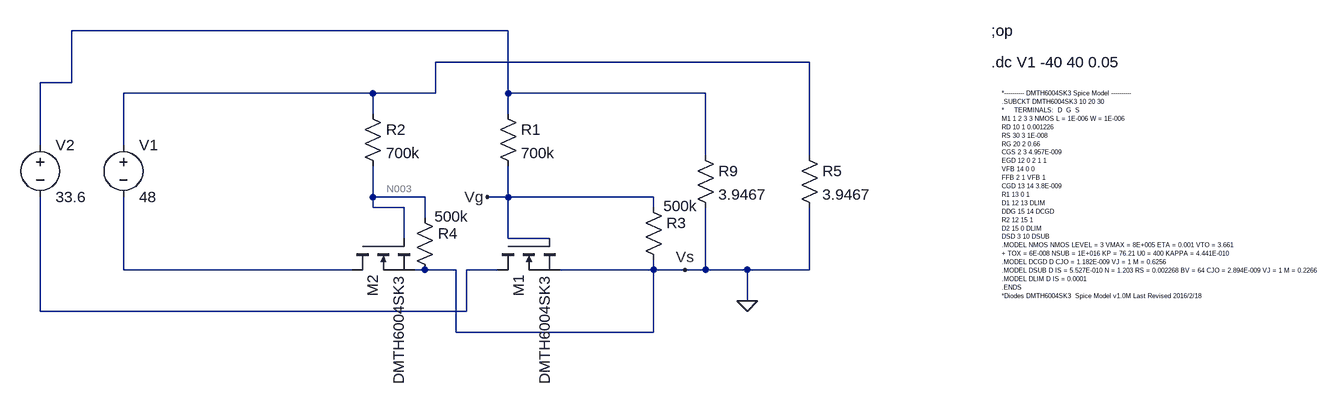
[diagram p0: schematic Dual Reverse Voltage Protection.asc]
Dual Reverse Voltage Protection.asc, the LTspice schematic file:
Version 4
SHEET 1 1812 680
WIRE 128 -992 -544 -992
WIRE 592 -944 16 -944
WIRE -544 -912 -544 -992
WIRE -544 -912 -592 -912
WIRE -80 -896 -464 -896
WIRE 16 -896 16 -944
WIRE 16 -896 -80 -896
WIRE 128 -896 128 -992
WIRE 432 -896 128 -896
WIRE -80 -864 -80 -896
WIRE 128 -864 128 -896
WIRE -592 -816 -592 -912
WIRE -464 -816 -464 -896
WIRE 432 -800 432 -896
WIRE 592 -800 592 -944
WIRE -80 -736 -80 -784
WIRE 0 -736 -80 -736
WIRE 128 -736 128 -784
WIRE 128 -736 96 -736
WIRE 352 -736 128 -736
WIRE -80 -720 -80 -736
WIRE -32 -720 -80 -720
WIRE 352 -720 352 -736
WIRE 0 -704 0 -736
WIRE -32 -672 -32 -720
WIRE 128 -672 128 -736
WIRE 192 -672 128 -672
WIRE -464 -624 -464 -736
WIRE -112 -624 -464 -624
WIRE 0 -624 -16 -624
WIRE 48 -624 0 -624
WIRE 112 -624 64 -624
WIRE 352 -624 352 -640
WIRE 352 -624 208 -624
WIRE 400 -624 352 -624
WIRE 432 -624 432 -720
WIRE 432 -624 400 -624
WIRE 496 -624 432 -624
WIRE 592 -624 592 -720
WIRE 592 -624 496 -624
WIRE 496 -576 496 -624
WIRE -592 -560 -592 -736
WIRE 64 -560 64 -624
WIRE 64 -560 -592 -560
WIRE 48 -528 48 -624
WIRE 352 -528 352 -624
WIRE 352 -528 48 -528
FLAG 496 -576 0
FLAG 400 -624 Vs
FLAG 96 -736 Vg
SYMBOL voltage -464 -832 R0
WINDOW 123 0 0 Left 2
WINDOW 39 0 0 Left 2
SYMATTR InstName V1
SYMATTR Value 48
SYMBOL res 112 -880 R0
SYMATTR InstName R1
SYMATTR Value 700k
SYMBOL res 336 -736 R0
WINDOW 3 31 14 Left 2
SYMATTR Value 500k
SYMATTR InstName R3
SYMBOL res 416 -816 R0
SYMATTR InstName R9
SYMATTR Value 3.9467
SYMBOL res -96 -880 R0
SYMATTR InstName R2
SYMATTR Value 700k
SYMBOL res -16 -720 R0
WINDOW 3 31 14 Left 2
SYMATTR Value 500k
SYMATTR InstName R4
SYMBOL nmos 112 -672 M90
SYMATTR InstName M1
SYMATTR Value DMTH6004SK3
SYMATTR Prefix X
SYMBOL nmos -112 -672 M90
SYMATTR InstName M2
SYMATTR Value DMTH6004SK3
SYMATTR Prefix X
SYMBOL voltage -592 -832 R0
WINDOW 123 0 0 Left 2
WINDOW 39 0 0 Left 2
SYMATTR InstName V2
SYMATTR Value 33.6
SYMBOL res 576 -816 R0
SYMATTR InstName R5
SYMATTR Value 3.9467
TEXT 872 -992 Left 2 !;op
TEXT 872 -944 Left 2 !.dc V1 -40 40 0.05
TEXT 888 -896 Left 0 !*---------- DMTH6004SK3 Spice Model ----------\n.SUBCKT DMTH6004SK3 10 20 30 \n*     TERMINALS:  D  G  S\nM1 1 2 3 3 NMOS L = 1E-006 W = 1E-006 \nRD 10 1 0.001226 \nRS 30 3 1E-008 \nRG 20 2 0.66 \nCGS 2 3 4.957E-009 \nEGD 12 0 2 1 1 \nVFB 14 0 0 \nFFB 2 1 VFB 1 \nCGD 13 14 3.8E-009 \nR1 13 0 1 \nD1 12 13 DLIM \nDDG 15 14 DCGD \nR2 12 15 1 \nD2 15 0 DLIM \nDSD 3 10 DSUB \n.MODEL NMOS NMOS LEVEL = 3 VMAX = 8E+005 ETA = 0.001 VTO = 3.661 \n+ TOX = 6E-008 NSUB = 1E+016 KP = 76.21 U0 = 400 KAPPA = 4.441E-010 \n.MODEL DCGD D CJO = 1.182E-009 VJ = 1 M = 0.6256 \n.MODEL DSUB D IS = 5.527E-010 N = 1.203 RS = 0.002268 BV = 64 CJO = 2.894E-009 VJ = 1 M = 0.2266 \n.MODEL DLIM D IS = 0.0001 \n.ENDS\n*Diodes DMTH6004SK3  Spice Model v1.0M Last Revised 2016/2/18

The netlist it stands for:
* Dual Reverse Voltage Protection.asc
V1 N002 N004 48
R1 N001 Vg 700k
R3 Vg 0 500k
R9 N001 0 3.9467
R2 N002 N003 700k
R4 N003 0 500k
XM1 N005 Vg 0 DMTH6004SK3  ; pins D G S
XM2 N004 N003 0 DMTH6004SK3  ; pins D G S
V2 N001 N005 33.6
R5 N002 0 3.9467
;op
.dc V1 -40 40 0.05
*---------- DMTH6004SK3 Spice Model ----------
.SUBCKT DMTH6004SK3 10 20 30
*     TERMINALS:  D  G  S
M1 1 2 3 3 NMOS L = 1E-006 W = 1E-006
RD 10 1 0.001226
RS 30 3 1E-008
RG 20 2 0.66
CGS 2 3 4.957E-009
EGD 12 0 2 1 1
VFB 14 0 0
FFB 2 1 VFB 1
CGD 13 14 3.8E-009
R1 13 0 1
D1 12 13 DLIM
DDG 15 14 DCGD
R2 12 15 1
D2 15 0 DLIM
DSD 3 10 DSUB
.MODEL NMOS NMOS LEVEL = 3 VMAX = 8E+005 ETA = 0.001 VTO = 3.661
+ TOX = 6E-008 NSUB = 1E+016 KP = 76.21 U0 = 400 KAPPA = 4.441E-010
.MODEL DCGD D CJO = 1.182E-009 VJ = 1 M = 0.6256
.MODEL DSUB D IS = 5.527E-010 N = 1.203 RS = 0.002268 BV = 64 CJO = 2.894E-009 VJ = 1 M = 0.2266
.MODEL DLIM D IS = 0.0001
.ENDS
*Diodes DMTH6004SK3  Spice Model v1.0M Last Revised 2016/2/18
.backanno
.end

* Results of the author's LTspice run, read from the files saved beside the schematic
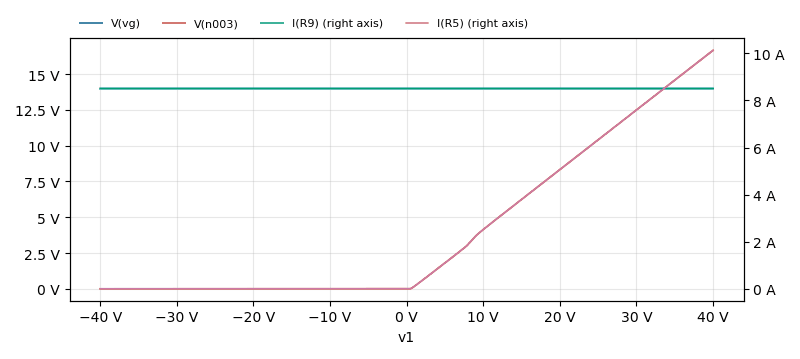
[diagram p1: DC transfer characteristic of Dual Reverse Voltage Protection.asc, plotted from the saved traces]
* DC transfer characteristic, 1 run:
*   V(vg): 13.99 V at v1=-40 V, 13.99 V at v1=40 V, min 13.99 V, max 13.99 V
*   V(n003): 11.67 µV at v1=-40 V, 16.66 V at v1=40 V, min -740.3 nV, max 16.66 V
*   I(R9): 8.508 A at v1=-40 V, 8.508 A at v1=40 V, min 8.508 A, max 8.508 A
*   I(R5): -696.6 pA at v1=-40 V, 10.13 A at v1=40 V, min -702.1 pA, max 10.13 A